# Altium schematic sheet PT100检测电路.SchDoc
size A3
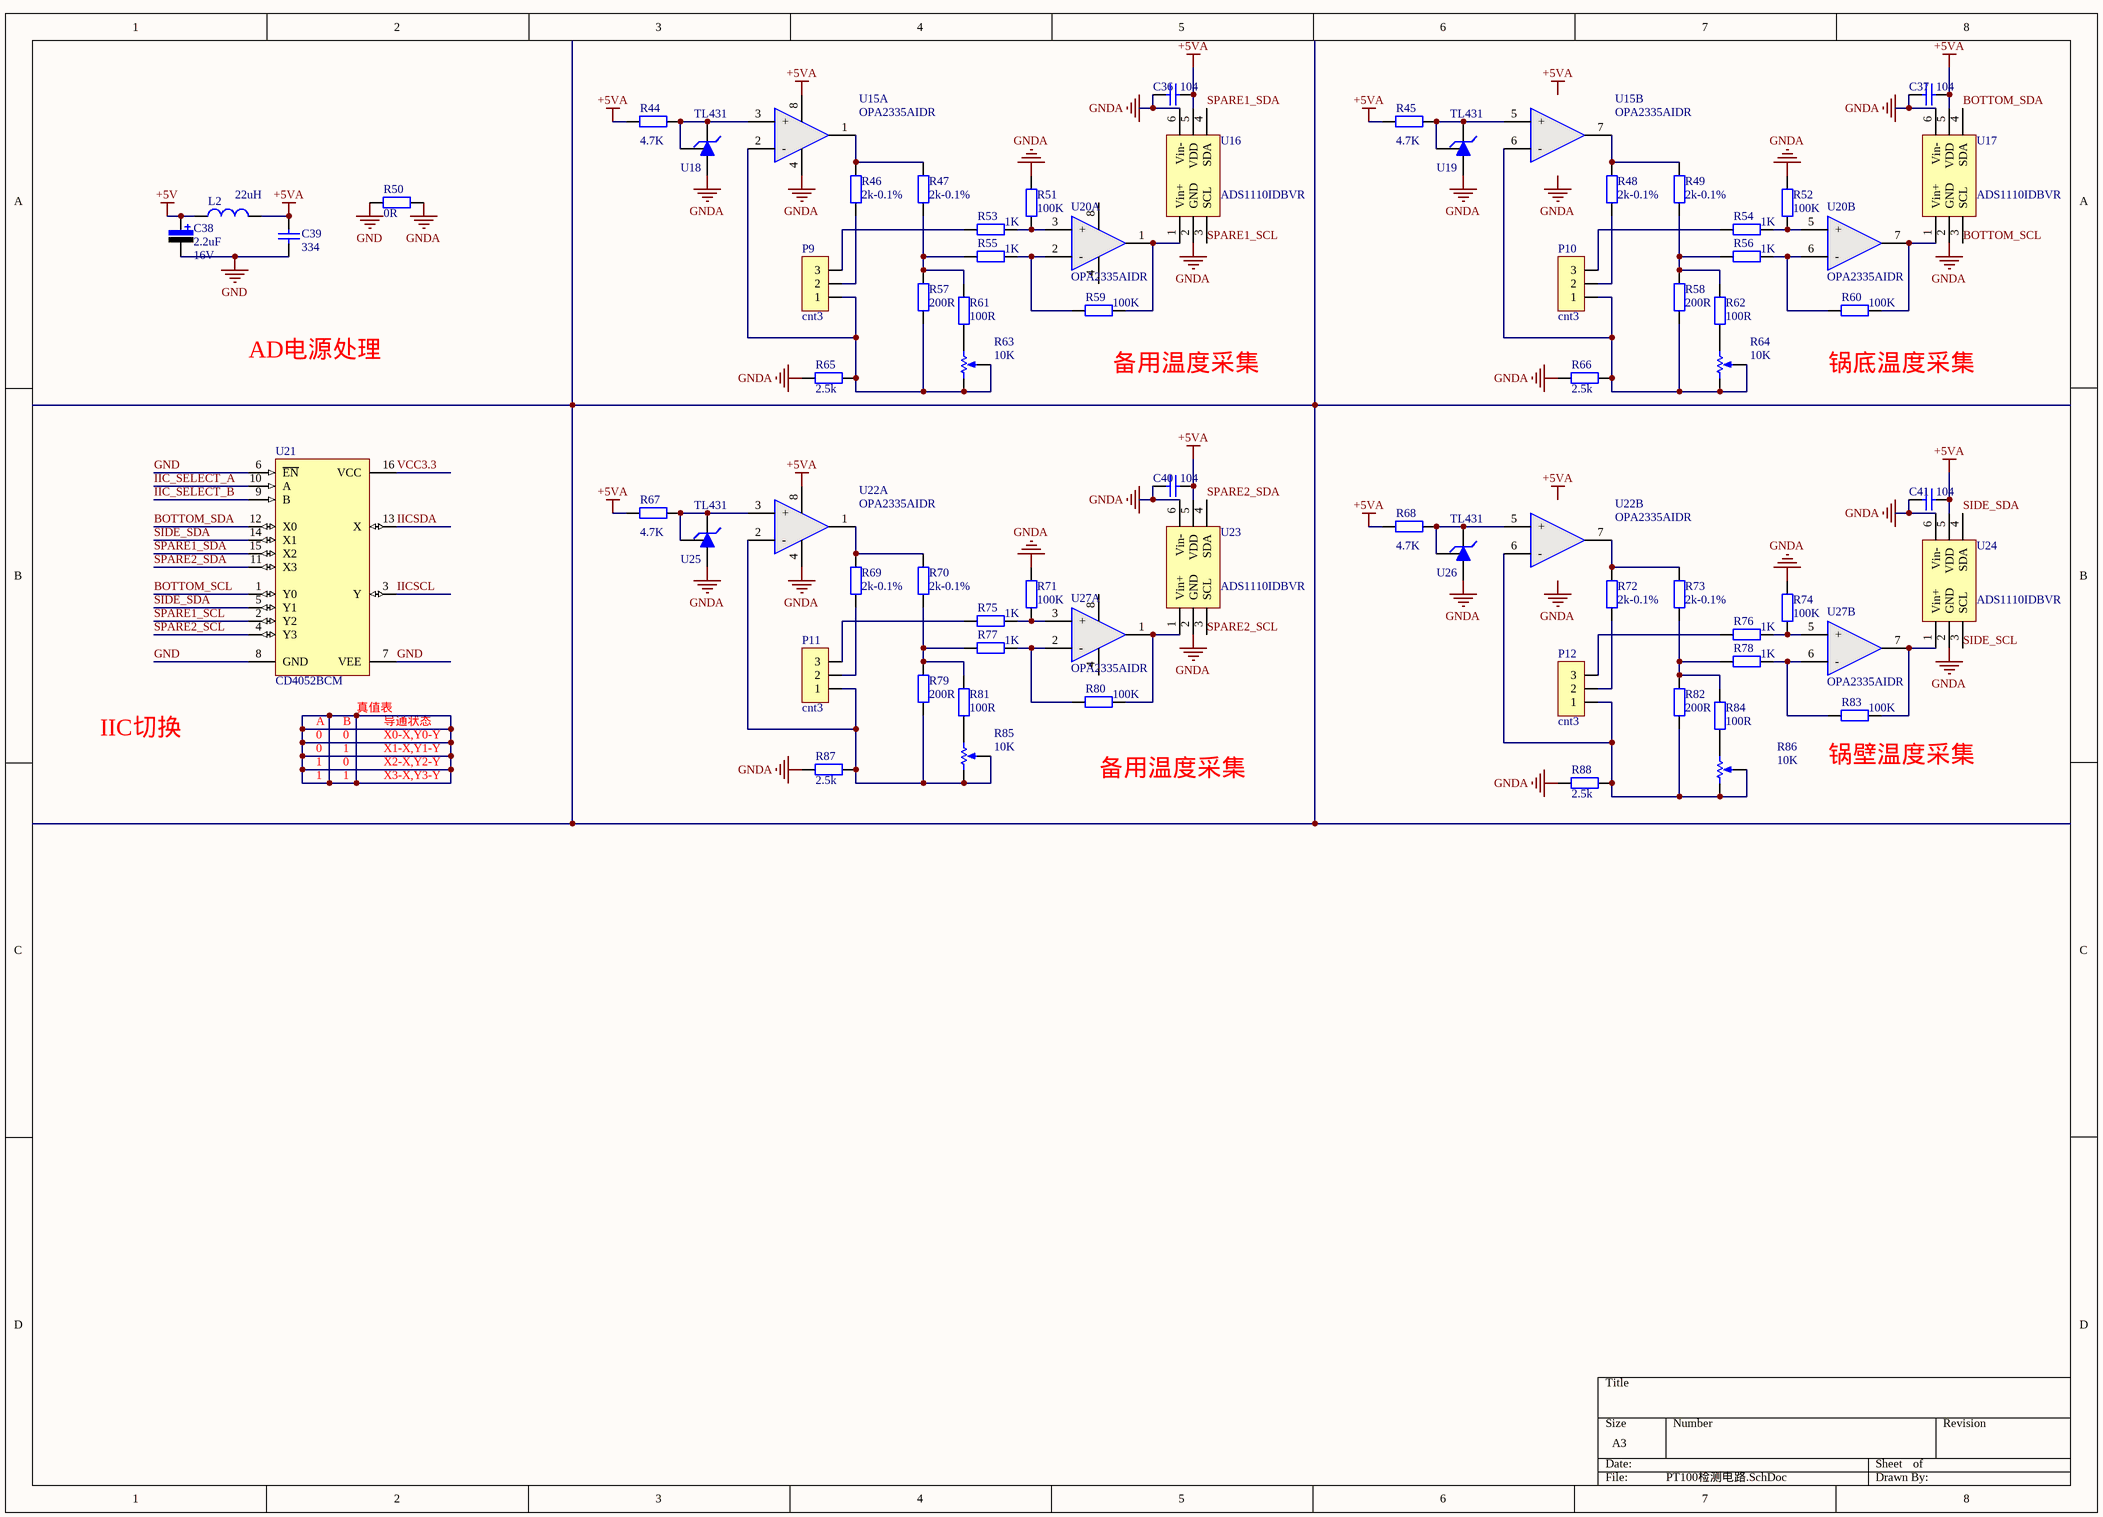
[diagram p0: PT100检测电路.SchDoc]

## Parts
C36  value 104  [C-RAD-0603]  (hidden comment: Cap)
C37  value 104  [C-RAD-0603]  (hidden comment: Cap)
C38  value 2.2uF  Vol: 16V  [CAP-3216]  (hidden comment: Cap Pol)
C39  value 334  [C-RAD-0603]  (hidden comment: Cap)
C40  value 104  [C-RAD-0603]  (hidden comment: Cap)
C41  value 104  [C-RAD-0603]  (hidden comment: Cap)
L2  value 22uH  [1206]  (hidden comment: Inductor)
P9  cnt3  [7.62mmPCB接线端子3p]
P10  cnt3  [7.62mmPCB接线端子3p]
P11  cnt3  [7.62mmPCB接线端子3p]
P12  cnt3  [7.62mmPCB接线端子3p]
R44  value 4.7K  [0603-1]  (hidden comment: Res1)
R45  value 4.7K  [0603-1]  (hidden comment: Res1)
R46  value 2k-0.1%  [0603-1]  (hidden comment: Res1)
R47  value 2k-0.1%  [0603-1]  (hidden comment: Res1)
R48  value 2k-0.1%  [0603-1]  (hidden comment: Res1)
R49  value 2k-0.1%  [0603-1]  (hidden comment: Res1)
R50  value 0R  [0603-1]  (hidden comment: Res1)
R51  value 100K  [0603-1]  (hidden comment: Res1)
R52  value 100K  [0603-1]  (hidden comment: Res1)
R53  value 1K  [0603-1]  (hidden comment: Res1)
R54  value 1K  [0603-1]  (hidden comment: Res1)
R55  value 1K  [0603-1]  (hidden comment: Res1)
R56  value 1K  [0603-1]  (hidden comment: Res1)
R57  value 200R  [0603-1]  (hidden comment: Res1)
R58  value 200R  [0603-1]  (hidden comment: Res1)
R59  value 100K  [0603-1]  (hidden comment: Res1)
R60  value 100K  [0603-1]  (hidden comment: Res1)
R61  value 100R  [0603-1]  (hidden comment: Res1)
R62  value 100R  [0603-1]  (hidden comment: Res1)
R63  value 10K  [VR-3266W]  (hidden comment: RPot)
R64  value 10K  [VR-3266W]  (hidden comment: RPot)
R65  value 2.5k  [0603-1]  (hidden comment: Res1)
R66  value 2.5k  [0603-1]  (hidden comment: Res1)
R67  value 4.7K  [0603-1]  (hidden comment: Res1)
R68  value 4.7K  [0603-1]  (hidden comment: Res1)
R69  value 2k-0.1%  [0603-1]  (hidden comment: Res1)
R70  value 2k-0.1%  [0603-1]  (hidden comment: Res1)
R71  value 100K  [0603-1]  (hidden comment: Res1)
R72  value 2k-0.1%  [0603-1]  (hidden comment: Res1)
R73  value 2k-0.1%  [0603-1]  (hidden comment: Res1)
R74  value 100K  [0603-1]  (hidden comment: Res1)
R75  value 1K  [0603-1]  (hidden comment: Res1)
R76  value 1K  [0603-1]  (hidden comment: Res1)
R77  value 1K  [0603-1]  (hidden comment: Res1)
R78  value 1K  [0603-1]  (hidden comment: Res1)
R79  value 200R  [0603-1]  (hidden comment: Res1)
R80  value 100K  [0603-1]  (hidden comment: Res1)
R81  value 100R  [0603-1]  (hidden comment: Res1)
R82  value 200R  [0603-1]  (hidden comment: Res1)
R83  value 100K  [0603-1]  (hidden comment: Res1)
R84  value 100R  [0603-1]  (hidden comment: Res1)
R85  value 10K  [VR-3266W]  (hidden comment: RPot)
R86  value 10K  [VR-3266W]  (hidden comment: RPot)
R87  value 2.5k  [0603-1]  (hidden comment: Res1)
R88  value 2.5k  [0603-1]  (hidden comment: Res1)
U15  OPA2335AIDR  [NSO8_N]  (parts A,B of 2)
U16  ADS1110IDBVR  [SOT23-6]
U17  ADS1110IDBVR  [SOT23-6]
U18  TL431  [SOT23]
U19  TL431  [SOT23]
U20  OPA2335AIDR  [NSO8_N]  (parts A,B of 2)
U21  CD4052BCM  [NSO16_M]
U22  OPA2335AIDR  [NSO8_N]  (parts A,B of 2)
U23  ADS1110IDBVR  [SOT23-6]
U24  ADS1110IDBVR  [SOT23-6]
U25  TL431  [SOT23]
U26  TL431  [SOT23]
U27  OPA2335AIDR  [NSO8_N]  (parts A,B of 2)

## Nets
+5V: C38.1 L2.1
+5VA: C36.2 C37.2 C39.1 C40.2 C41.2 L2.2 R44.1 R45.1 R67.1 R68.1 U15.8(V+) U16.5(VDD) U17.5(VDD) U22.8(V+) U23.5(VDD) U24.5(VDD)
GND: C38.2 C39.2 R50.2 U21.6(~{EN}) U21.7(VEE) U21.8(GND)
GNDA: C36.1 C37.1 C40.1 C41.1 R50.1 R51.2 R52.2 R65.1 R66.1 R71.2 R74.2 R87.1 R88.1 U15.4(V-) U16.2(GND) U16.6(Vin-) U17.2(GND) U17.6(Vin-) U18.3 U19.3 U22.4(V-) U23.2(GND) U23.6(Vin-) U24.2(GND) U24.6(Vin-) U25.3 U26.3
BOTTOM_SCL: U17.3(SCL) U21.1(Y0)
BOTTOM_SDA: U17.4(SDA) U21.12(X0)
IIC_SELECT_A: U21.10(A)
IIC_SELECT_B: U21.9(B)
IICSCL: U21.3(Y)
IICSDA: U21.13(X)
SIDE_SCL: U24.3(SCL)
SIDE_SDA: U21.5(Y1) U21.14(X1) U24.4(SDA)
SPARE1_SCL: U16.3(SCL) U21.2(Y2)
SPARE1_SDA: U16.4(SDA) U21.15(X2)
SPARE2_SCL: U21.4(Y3) U23.3(SCL)
SPARE2_SDA: U21.11(X3) U23.4(SDA)
VCC3.3: U21.16(VCC)
NetP9_1: P9.1 R57.1 R63.1(TOP) R63.2(TAP) R65.2 U15.2(-)
NetP9_2: P9.2 R46.1
NetP9_3: P9.3 R53.1
NetP10_1: P10.1 R58.1 R64.1(TOP) R64.2(TAP) R66.2 U15.6(-)
NetP10_2: P10.2 R48.1
NetP10_3: P10.3 R54.1
NetP11_1: P11.1 R79.1 R85.1(TOP) R85.2(TAP) R87.2 U22.2(-)
NetP11_2: P11.2 R69.1
NetP11_3: P11.3 R75.1
NetP12_1: P12.1 R82.1 R86.1(TOP) R86.2(TAP) R88.2 U22.6(-)
NetP12_2: P12.2 R72.1
NetP12_3: P12.3 R76.1
NetR44_2: R44.2 U15.3(+) U18.1 U18.2
NetR45_2: R45.2 U15.5(+) U19.1 U19.2
NetR46_2: R46.2 R47.2 U15.1(OUT1)
NetR47_1: R47.1 R55.1 R57.2 R61.2
NetR48_2: R48.2 R49.2 U15.7(OUT2)
NetR49_1: R49.1 R56.1 R58.2 R62.2
NetR51_1: R51.1 R53.2 U20.3(+)
NetR52_1: R52.1 R54.2 U20.5(+)
NetR55_2: R55.2 R59.1 U20.2(-)
NetR56_2: R56.2 R60.1 U20.6(-)
NetR59_2: R59.2 U16.1(Vin+) U20.1(OUT1)
NetR60_2: R60.2 U17.1(Vin+) U20.7(OUT2)
NetR61_1: R61.1 R63.3(BOT)
NetR62_1: R62.1 R64.3(BOT)
NetR67_2: R67.2 U22.3(+) U25.1 U25.2
NetR68_2: R68.2 U22.5(+) U26.1 U26.2
NetR69_2: R69.2 R70.2 U22.1(OUT1)
NetR70_1: R70.1 R77.1 R79.2 R81.2
NetR71_1: R71.1 R75.2 U27.3(+)
NetR72_2: R72.2 R73.2 U22.7(OUT2)
NetR73_1: R73.1 R78.1 R82.2 R84.2
NetR74_1: R74.1 R76.2 U27.5(+)
NetR77_2: R77.2 R80.1 U27.2(-)
NetR78_2: R78.2 R83.1 U27.6(-)
NetR80_2: R80.2 U23.1(Vin+) U27.1(OUT1)
NetR81_1: R81.1 R85.3(BOT)
NetR83_2: R83.2 U24.1(Vin+) U27.7(OUT2)
NetR84_1: R84.1 R86.3(BOT)

Not connected (* = marked no-connect by the designer): U20 4(V-) 8(V+); U27 4(V-) 8(V+)

## Notes on the sheet
- AD电源处理
- (near R59) 备用温度采集
- (near R60) 锅底温度采集
- A
- B
- (near U21) 真值表
- 导通状态
- IIC切换
- 0
- 1
- X0-X,Y0-Y
- X1-X,Y1-Y
- X2-X,Y2-Y
- X3-X,Y3-Y
- 备用温度采集
- (near R83) 锅壁温度采集
- Labels drawn without touching a wire or pin: +5VA, GNDA

## Library data of the parts
C36 C37 C39-C41 = Cap: 无极性电容; Published: 8-Jun-2000; LatestRevisionDate: 17-Jul-2002; LatestRevisionNote: Re-released for DXP Platform.; PackageReference: RAD-0.3; Publisher: Altium Limited
C38 = Cap Pol: 极性电解电容; Published: 8-Jun-2000; LatestRevisionDate: 17-Jul-2002; LatestRevisionNote: Re-released for DXP Platform.; PackageReference: RB7.6-15; Publisher: Altium Limited
L2 = Inductor: 电感; Code_IEC: 1005; Published: 8-Jun-2000; LatestRevisionDate: 17-Jul-2002; LatestRevisionNote: Re-released for DXP Platform.; PackageReference: 0402-A; Publisher: Altium Limited; Code_JEITA: 0402
P9-P12 = cnt3: 3p接线端子
R44-R62 R65-R84 R87 R88 = Res1: 贴片电阻; Published: 8-Jun-2000; LatestRevisionDate: 17-Jul-2002; LatestRevisionNote: Re-released for DXP Platform.; PackageReference: AXIAL-0.4; Publisher: Altium Limited
R63 R64 R85 R86 = RPot: 精密可调电阻; Sim Note: Enter the Resistance value and the set point into parameter fields.; Set Position: 0.5; Published: 8-Jun-2000; LatestRevisionDate: 17-Jul-2002; LatestRevisionNote: Re-released for DXP Platform.; PackageReference: VR5; Publisher: Altium Limited
U15 U20 U22 U27 = AD8667: 双运放
U16 U17 U23 U24 = ADS1110IDBVR: 16位内部基准AD芯片IIC
U21 = CD4052BCM: 双通道模拟开关; Published: 17-Jul-2002; LatestRevisionDate: 13-Apr-2006; LatestRevisionNote: IPC-7351 Footprint Added.; DatasheetVersion: Jan-1999; PackageVersion: 2000; PackageReference: M16A; Publisher: Altium Limited; PackageDescription: 16-Pin Small Outline Integrated Circuit 1.27 mm Pitch; Code_IPC: SOIC127P600-16; ComponentLink1Description: Manufacturer Link; ComponentLink1URL: http://www.fairchildsemi.com/; ComponentLink2Description: Datasheet; ComponentLink2URL: http://www.fairchildsemi.com/ds/CD%2FCD4052BC.pdf